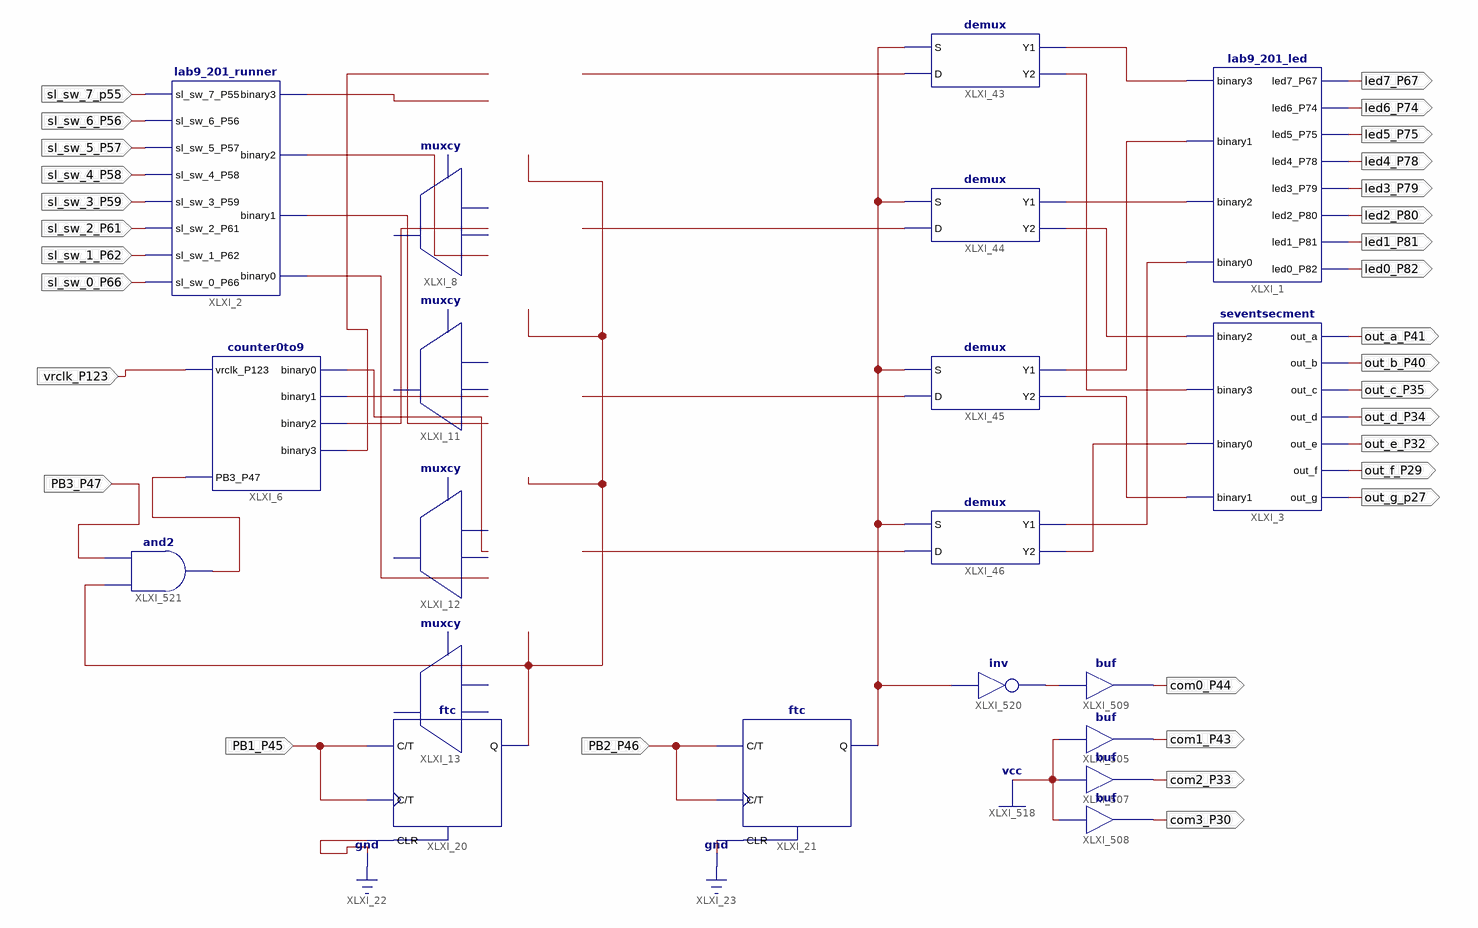
[diagram p0: schematic sheet 1]
// Xilinx ISE schematic lab9_main.sch (spartan6) as structural Verilog: 20 symbols, 31 ports
module lab9_main (
  input  sl_sw_7_p55,
  input  sl_sw_6_P56,
  input  sl_sw_5_P57,
  input  sl_sw_4_P58,
  input  sl_sw_3_P59,
  input  sl_sw_2_P61,
  input  sl_sw_1_P62,
  input  sl_sw_0_P66,
  input  vrclk_P123,
  input  PB2_P46,
  input  PB1_P45,
  input  PB3_P47,
  output led7_P67,
  output led6_P74,
  output led5_P75,
  output led4_P78,
  output led3_P79,
  output led2_P80,
  output led1_P81,
  output led0_P82,
  output out_a_P41,
  output out_b_P40,
  output out_c_P35,
  output out_d_P34,
  output out_e_P32,
  output out_f_P29,
  output out_g_p27,
  output com1_P43,
  output com2_P33,
  output com3_P30,
  output com0_P44
);

  wire Dip_sw2, XLXN_15, XLXN_16, XLXN_17, XLXN_18, XLXN_81, XLXN_82, XLXN_83, XLXN_84, XLXN_85, XLXN_86,
       XLXN_88, XLXN_89, XLXN_90, XLXN_91, XLXN_94, XLXN_95, XLXN_96, XLXN_97, XLXN_98, XLXN_99, XLXN_100,
       XLXN_101, XLXN_107;

  lab9_201_runner XLXI_2 (
    .sl_sw_7_P55(sl_sw_7_p55), .sl_sw_6_P56(sl_sw_6_P56), .sl_sw_5_P57(sl_sw_5_P57),
    .sl_sw_4_P58(sl_sw_4_P58), .sl_sw_3_P59(sl_sw_3_P59), .sl_sw_2_P61(sl_sw_2_P61),
    .sl_sw_1_P62(sl_sw_1_P62), .sl_sw_0_P66(sl_sw_0_P66), .binary3(XLXN_81), .binary2(XLXN_82),
    .binary1(XLXN_83), .binary0(XLXN_84));
  counter0to9 XLXI_6 (
    .vrclk_P123(vrclk_P123), .PB3_P47(XLXN_107), .binary0(XLXN_85), .binary1(XLXN_86), .binary2(XLXN_88),
    .binary3(XLXN_89));
  lab9_201_led XLXI_1 (
    .binary3(XLXN_90), .binary1(XLXN_95), .binary2(XLXN_94), .binary0(XLXN_96), .led7_P67(led7_P67),
    .led6_P74(led6_P74), .led5_P75(led5_P75), .led4_P78(led4_P78), .led3_P79(led3_P79), .led2_P80(led2_P80),
    .led1_P81(led1_P81), .led0_P82(led0_P82));
  seventsecment XLXI_3 (
    .binary2(XLXN_98), .binary3(XLXN_97), .binary0(XLXN_100), .binary1(XLXN_99), .out_a(out_a_P41),
    .out_b(out_b_P40), .out_c(out_c_P35), .out_d(out_d_P34), .out_e(out_e_P32), .out_f(out_f_P29),
    .out_g(out_g_p27));
  muxcy XLXI_8 (.CI(XLXN_89), .DI(XLXN_81), .S(XLXN_101), .O(XLXN_15));
  muxcy XLXI_11 (.CI(XLXN_88), .DI(XLXN_82), .S(XLXN_101), .O(XLXN_16));
  muxcy XLXI_12 (.CI(XLXN_86), .DI(XLXN_83), .S(XLXN_101), .O(XLXN_17));
  muxcy XLXI_13 (.CI(XLXN_85), .DI(XLXN_84), .S(XLXN_101), .O(XLXN_18));
  ftc XLXI_21 (.C(PB2_P46), .CLR(1'b0), .T(PB2_P46), .Q(XLXN_91));
  ftc XLXI_20 (.C(PB1_P45), .CLR(1'b0), .T(PB1_P45), .Q(XLXN_101));
  demux XLXI_43 (.S(XLXN_91), .D(XLXN_15), .Y1(XLXN_90), .Y2(XLXN_97));
  demux XLXI_44 (.S(XLXN_91), .D(XLXN_16), .Y1(XLXN_94), .Y2(XLXN_98));
  demux XLXI_45 (.S(XLXN_91), .D(XLXN_17), .Y1(XLXN_95), .Y2(XLXN_99));
  demux XLXI_46 (.S(XLXN_91), .D(XLXN_18), .Y1(XLXN_96), .Y2(XLXN_100));
  buf XLXI_505 (com1_P43, 1'b1);
  buf XLXI_507 (com2_P33, 1'b1);
  buf XLXI_508 (com3_P30, 1'b1);
  buf XLXI_509 (com0_P44, Dip_sw2);
  not XLXI_520 (Dip_sw2, XLXN_91);
  and XLXI_521 (XLXN_107, XLXN_101, PB3_P47);
endmodule
